# EAGLE design SparkFun_Rotary_Encoder-Illuminated (EAGLE 7.2.0)
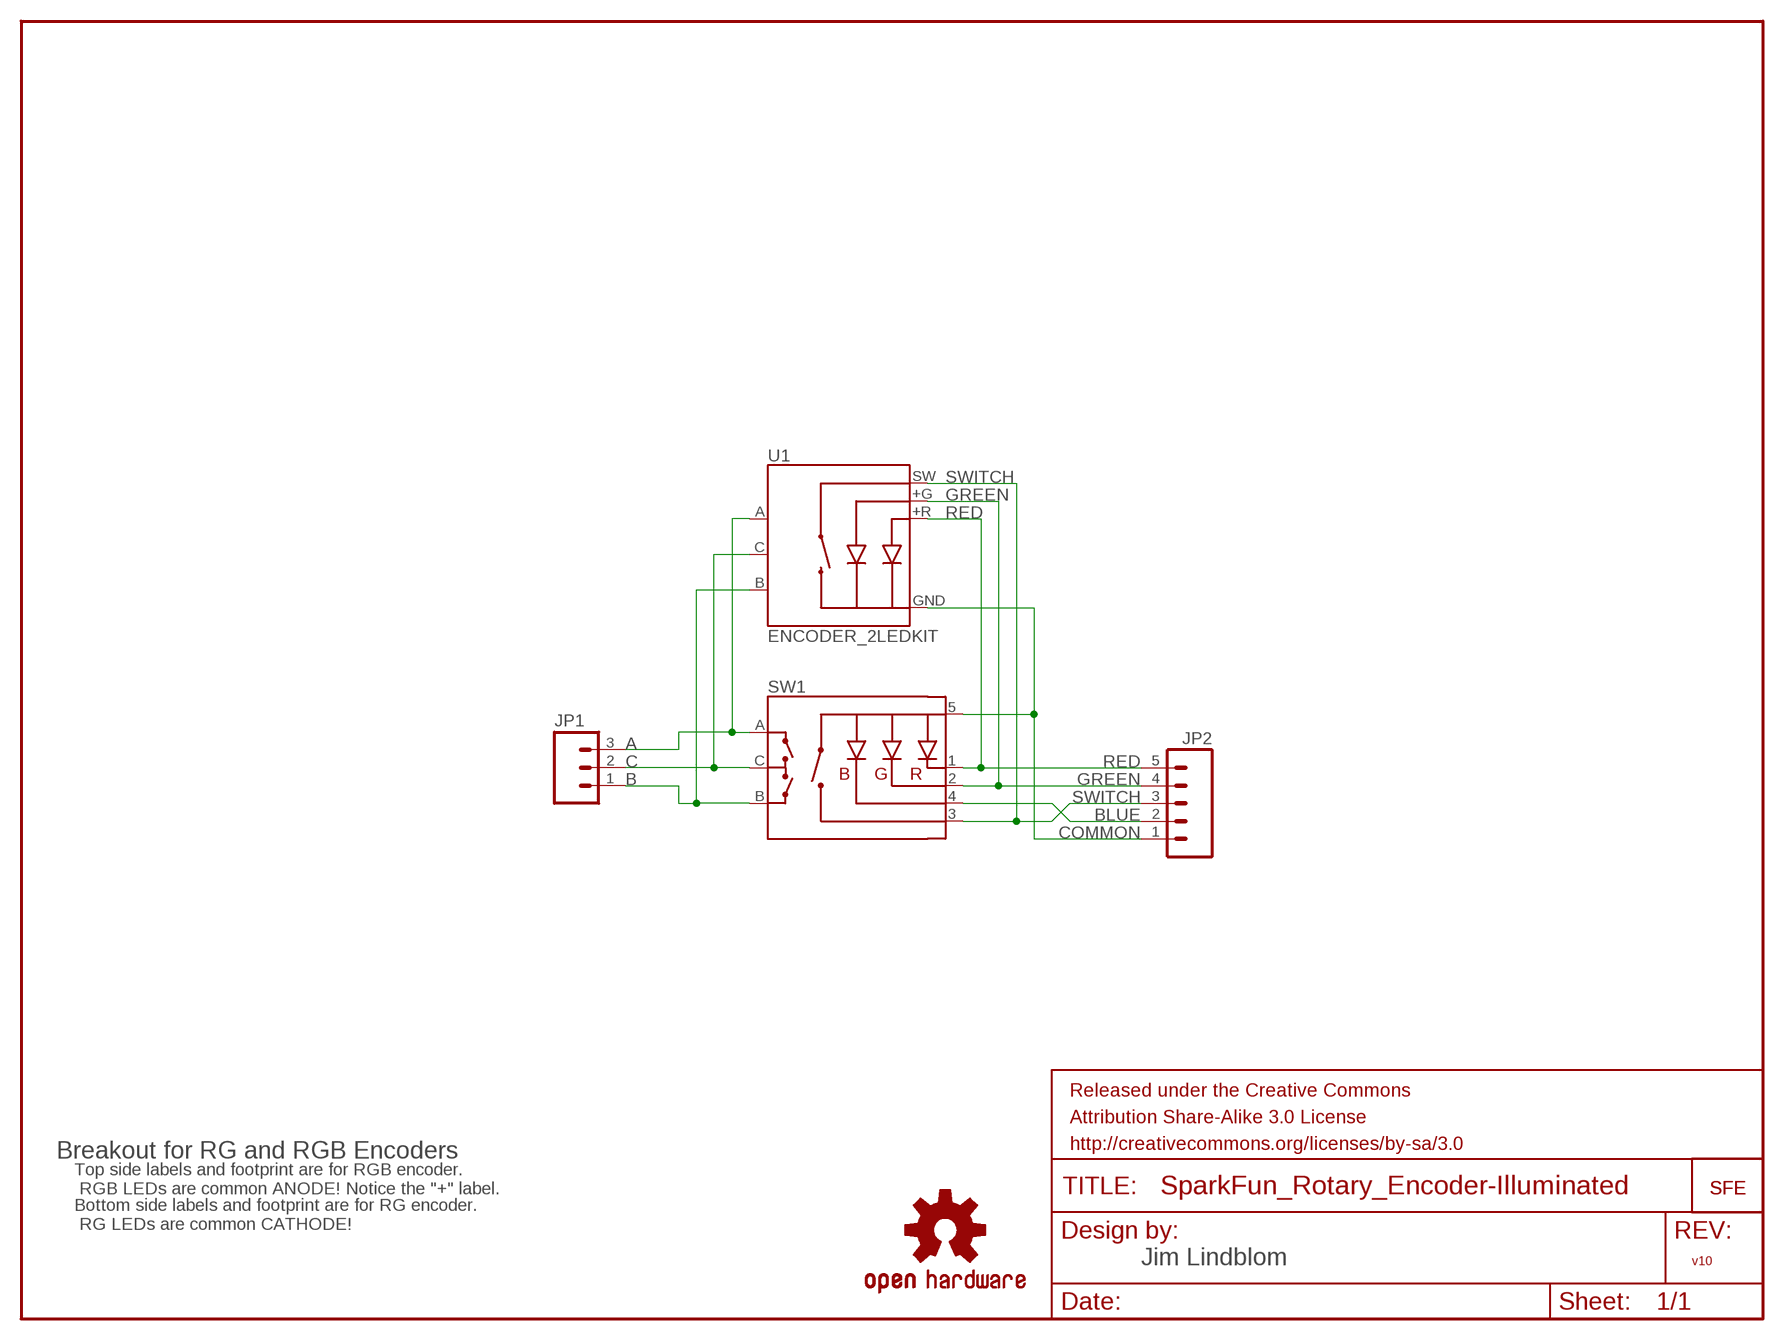
[diagram p0: schematic, sheet 1]

## Parts
FRAME1  FRAME-LETTER  [CREATIVE_COMMONS]
JP1  M03PTH  [1X03]
JP2  M05PTH  [1X05]
JP3  LOGO-SFESK  [SFE-LOGO-FLAME]
JP4  LOGO-SFESK  [SFE-LOGO-FLAME]
SW1  ENCODER_RGB_CAKIT  [ENCODER_LED_3_KIT]
U1  ENCODER_2LEDKIT  [ENCODER_LED_2_KIT]
U$2  OSHW-LOGOS  [OSHW-LOGO-S]

## Nets
A: JP1.3 SW1.A U1.A
B: JP1.1 SW1.B U1.B
BLUE: JP2.2 SW1.4(-B)
C: JP1.2 SW1.C U1.C
COMMON: JP2.1 SW1.5(+) U1.GND(-)
GREEN: JP2.4 SW1.2(-G) U1.+G
RED: JP2.5 SW1.1(-R) U1.+R
SWITCH: JP2.3 SW1.3(SW) U1.SW

## Notes on the sheet
- Breakout for RG and RGB Encoders
- Top side labels and footprint are for RGB encoder.
   RGB LEDs are common ANODE! Notice the "+" label.
- Bottom side labels and footprint are for RG encoder.
   RG LEDs are common CATHODE!
- Jim Lindblom | v10

## Library data of the parts
FRAME1 = SparkFun-Aesthetics:FRAME-LETTER: Schematic Frame Standard 8.5x11 US Letter frame
JP1 = SparkFun-Connectors:M03: Header 3 Standard 3-pin 0.1" header. Use with straight break away headers (SKU : PRT-00116), right angle break away headers (PRT-00553), swiss pins (PRT-00743), machine pins (PRT-00117), and female headers (PRT-00115). Molex polarized connector foot print use with SKU : PRT-08232 with associated crimp pins and housings.
JP2 = SparkFun-Connectors:M05: Header 5 Standard 5-pin 0.1" header. Use with straight break away headers (SKU : PRT-00116), right angle break away headers (PRT-00553), swiss pins (PRT-00743), machine pins (PRT-00117), and female headers (PRT-00115). Molex polarized connector foot print use with SKU : PRT-08230 with associated crimp pins and housings.
JP3 JP4 = SparkFun-Aesthetics:LOGO-SFE: Spark Fun Electronics PCB Logo This is the standard Spark Fun Electronics PCB logo.
SW1 = SparkFun-Electromechanical:ENCODER_RGB_CA: Illuminated Rotary Encoder w/ RGB LED and select switch EC12PLRGBSDVBF-D: http://top-up.so-buy.com/front/bin/ptdetail.phtml?Part=EC12PLRGBSDVBF-D
U1 = SparkFun-Electromechanical:ENCODER_2LED: Illuminated Rotary Encoder w/ 2 LEDs
U$2 = SparkFun-Aesthetics:OSHW-LOGO: Open Source Hardware Logo This logo indicates the piece of hardware it is found on incorporates a OSHW license and/or adheres to the definition of open source hardware found here: http://freedomdefined.org/OSHW

## Board
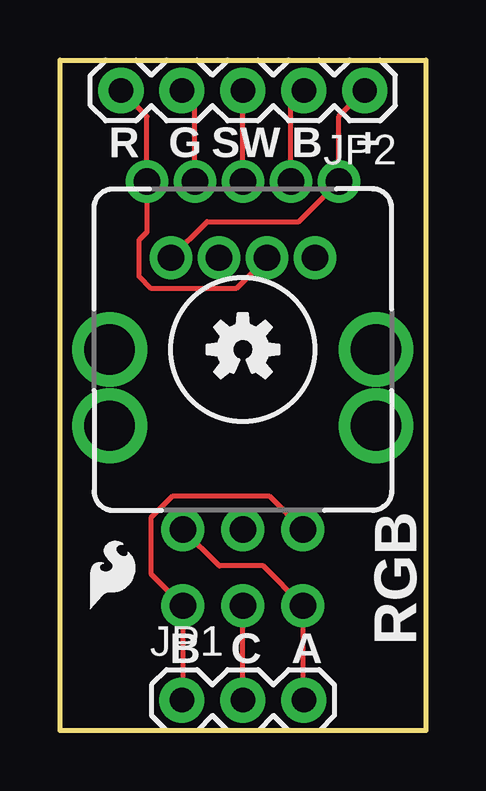
[diagram p1: board, top side]
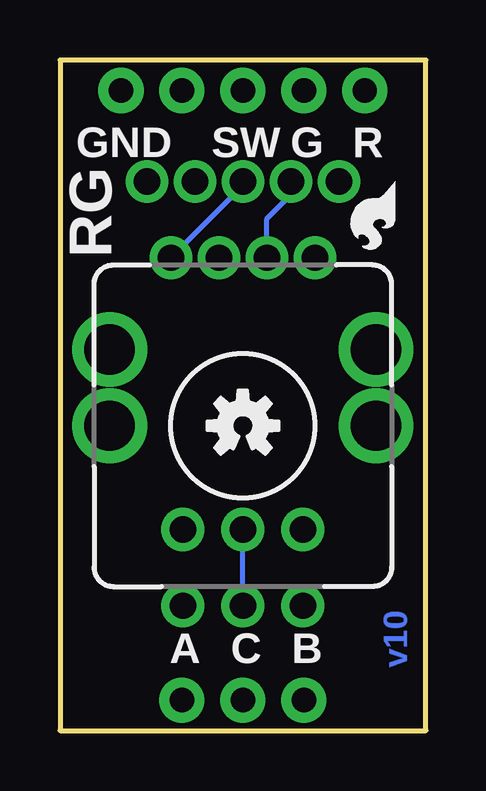
[diagram p2: board, bottom side, seen from below]

Size 15.24 x 27.94 mm. Coordinates in mm from the lower left corner, seen from the top.
Outline: 15.24,27.94 15.24,0 0,0 0,27.94 15.24,27.94
Copper layers (1*16): Top 0.035mm / dielectric 1.5mm / Bottom 0.035mm
Design rules "SparkFun": minimum track width 8mil, minimum drill 20mil, track to track 8mil, track to pad 8mil, pad to pad 8mil, via to via 8mil, smd to smd 8mil, copper to edge 8mil, drill to drill 8mil, minimum pad ring 12mil, minimum via ring 10mil, stop-mask expansion 4mil, vias tented up to drill 20mil, thermal gap 10mil

### Footprints (pad centres in the part's own frame; a part is rotated, then mirrored left to right if it is on the bottom)
1X03 = drill 1.016 pad 1.88: 1 0,0; 2 2.54,0; 3 5.08,0
1X05 = drill 1.016 pad 1.88: 1 0,0; 2 2.54,0; 3 5.08,0; 4 7.62,0; 5 10.16,0
ENCODER_LED_3_KIT = drill 1.1 pad 1.778: 1 -4,7; 2 -2,7; 3 0,7; 4 2,7; 5 4,7 | drill 1.1 pad 1.8: A -2.5,-7.5; B 2.5,-7.5; C 0,-7.5 | drill 2.1: M1 -5.55,0; M2 5.55,0
ENCODER_LED_2_KIT = drill 1.1 pad 1.778: +G 1,7; +R -1,7; GND 3,7; SW -3,7 | drill 1.1 pad 1.8: A -2.5,-7.5; B 2.5,-7.5; C 0,-7.5 | drill 2.1: P$1 -5.55,0; P$2 5.55,0

### Placement (x,y rotation side)
FRAME1  -17.78,-5.08 0 top  (outside the outline)
JP1  5.08,1.27 0 top
JP2  12.7,26.67 180 top
JP3  1.27,5.08 0 top
JP4  1.27,22.86 180 bottom
SW1  7.62,15.88 0 top
U1  7.62,12.7 0 bottom
U$1  OSHW-LOGOS  [OSHW-LOGO-S]  7.62,15.88 0 top
U$2  7.62,12.7 0 bottom

### Tracks (layer width: path | path; a pad name or v marks a point on that pad's centre or on a via)
A
  Top 0.203: SW1.A 6.64,6.86 8.46,6.86 U1.A 10.12,1.31 JP1.3
B
  Top 0.203: SW1.B 8.72,9.78 4.7,9.78 3.81,8.89 3.81,6.51 U1.B 5.12,1.31 JP1.1
BLUE
  Top 0.203: SW1.4 9.62,26.13 JP2.2
C
  Top 0.203: JP1.2 U1.C
  Bottom 0.203: U1.C SW1.C
COMMON
  Top 0.203: U1.GND 6.13,21.21 9.95,21.21 SW1.5 11.62,25.59 JP2.1
GREEN
  Top 0.203: SW1.2 5.62,26.13 JP2.4
  Bottom 0.203: U1.+G 6.62,21.32 5.62,22.32 SW1.2
RED
  Top 0.203: JP2.5 3.62,25.59 SW1.1 3.62,20.77 3.3,20.45 3.3,18.92 3.81,18.41 7.33,18.41 U1.+R
SWITCH
  Top 0.203: SW1.3 JP2.3
  Bottom 0.203: U1.SW 7.62,22.7 SW1.3

### Text on the board
Bottom: v10
tPlace: R | G | SW | B | + | RGB | B | C | A
bPlace: R | G | SW | GND | RG | B | C | A